# Altium schematic sheet [1] Supply.SchDoc
size A4
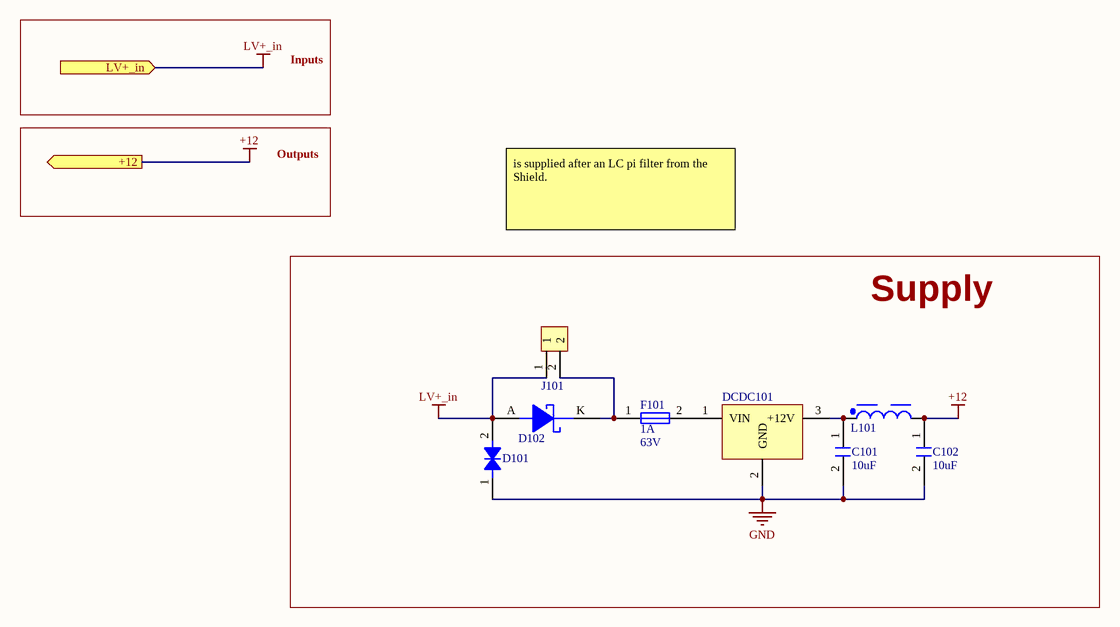
[diagram p0: [1] Supply.SchDoc]

## Parts
C101  Capacitance: 10uF  [C10u-50V-1210FNPMLCC-X7R]  (hidden comment: GRJ32ER71H106KE11L)
C102  Capacitance: 10uF  [C10u-50V-1210FNPMLCC-X7R]  (hidden comment: GRJ32ER71H106KE11L)
D101  824551301  [DTVS-DO-214AB]  (value not drawn)
D102  MBR0530  [DSC-SOD123]  (value not drawn)
DCDC101  173951236  [DCDC_Magi3c]  (value not drawn)
F101  Current Rating: 1A  Voltage Rating (DC): 63V  [Fuse_1206]  (hidden comment: 0437001.WRA)
J101  61300211121  [J_Pinheader_1x2]  (value not drawn)
L101  744042470  [L_Power_ 47uH]  (value not drawn)

## Blocks framed on the sheet
Supply: C101 C102 D101 D102 DCDC101 F101 J101 L101

## Ports
+12 (out), LV+_in (in)

## Nets
+12: C102.1 L101.2 ; port +12
GND: C101.2 C102.2 D101.1 DCDC101.2(GND)
LV+_in: D101.2 D102.A J101.1 ; port LV+_in
NetC101_1: C101.1 DCDC101.3(+12V) L101.1
NetD102_K: D102.K F101.1 J101.2
NetDCDC101_1: DCDC101.1(VIN) F101.2

## Notes on the sheet
- Inputs
- Outputs
- is supplied after an LC pi filter from the Shield.

## Library data of the parts
C101 C102 = C10u-50V-1210FNPMLCC-X7R: Multilayer Ceramic Capacitors MLCC - SMD/SMT 1210 10uF 50volts X7R +/-10% Soft Term; Manufacturer: Murata; Voltage Rating: 50V; Tolerance: 10%; .Creator: DR; Supplier 1: Avnet; Manufacturer Part Number: GRJ32ER71H106KE11L; RoHS: Yes; Category: Ceramic Capacitors; Stock 1: 19000; Pricing 1: 1000=0,33327, 2000=0,32389, 4000=0,31450, 6000=0,30511, 8000=0,29572 (USD); Mount: Surface Mount; Case/Package: 1210; Case Code (Metric): 3225; Case Code (Imperial): 1210; Min Operating Temperature: -55°C; Max Operating Temperature: 125°C; Packaging: Tape and Reel; Features: Soft Termination; Length: 0.126inch; Width: 0.098inch; Thickness: 0.11inch; RoHS Compliant: Yes; ComponentLink1URL: https://eu.mouser.com/datasheet/2/281/GRJ32ER71H106KE11_01-1977929.pdf; ComponentLink1Description: Datasheet; Supplier Part Number 1: GRJ32ER71H106KE11L
D101 = DTVS-40V-DO-214AB: TVS diode [Würth Elektronik] 824551301 TVS diode; Manufacturer: Wurth Electronics; Number of Bidirectional Channels: 1; Reverse Standoff Voltage: 30V; Min Breakdown Voltage: 35.05V; Clamping Voltage: 48.4V; Peak Pulse Power: 3kW; Power Line Protection: No; Polarity: Bidirectional; Peak Pulse Current: 62A; .Creator: DO; ComponentLink2Description: Where buy it; ComponentLink2URL: https://www.we-online.com/catalog/en/WE-TVSP?sq=824551301#824551301; Supplier 1: RSComponents; Manufacturer Part Number: 824551301; RoHS: Yes; Category: TVS Diodes; Stock 1: 1; Pricing 1: 10=1,72500, 50=1,54700, 100=1,45300, 250=1,35100, 500=1,15000 (USD); Mount: Surface Mount; Number of Pins: 2; Min Operating Temperature: -65°C; Max Operating Temperature: 150°C; Packaging: Cut Tape; Max Breakdown Voltage: 35.05V; Resistor Type: Zener; REACH SVHC: Unknown; RoHS Compliant: Yes; ComponentLink1URL: http://www.farnell.com/datasheets/2036459.pdf?src-supplier=Element14; ComponentLink1Description: http://www.farnell.com/datasheets/2036459.pdf?src-supplier=Element14; Supplier Part Number 1: 9217092P
D102 = DSC-0.5/30-SOD123: VR=30V IF=500mA 30pF P=410mW; Element Configuration: Single; Forward Voltage: 430mV; Peak Non-Repetitive Surge Current: 5.5A; Average Rectified Current: 500mA; Max Reverse Leakage Current: 130uA; Max Reverse Voltage (DC): 30V; Polarity: Standard; .Creator: GP; Category: Diode; ComponentLink1Description: Datasheet; ComponentLink1URL: *; ComponentLink2Description: Where buy it; ComponentLink2URL: *; Supplier 1: Newark; Stock 1: 9; Pricing 1: 1=0,34400, 10=0,23900, 100=0,12200, 500=0,10000 (USD); Mount: Surface Mount; Contact Plating: Tin,Matte; Weight: 0.03g; Package Quantity: 1; Max Surge Current: 5.5A; Forward Current: 500mA; Max Reverse Current: 130uA; Max Repetitive Reverse Voltage (Vrrm): 30V; Max Forward Surge Current (Ifsm): 5.5A; Voltage Rating (DC): 30V; Current Rating: 500mA; Output Current: 500mA; Series: -; Length: 2.7mm; Width: 1.6mm; Height: 1.03mm; Radiation Hardening: No; RoHS Compliant: Yes; REACH SVHC: No SVHC; Lead Free: Lead Free; ComponentLink3URL: https://datasheet.ciiva.com/30479/0900766b810e2512-30479401.pdf?src-supplier=RSComponents; ComponentLink3Description: https://datasheet.ciiva.com/30479/0900766b810e2512-30479401.pdf?src-supplier=RSComponents; ComponentLink4URL: https://datasheet.ciiva.com/34301/974753-34301826.pdf?src-supplier=Jameco; ComponentLink4Description: https://datasheet.ciiva.com/34301/974753-34301826.pdf?src-supplier=Jameco; ComponentLink5URL: https://datasheet.ciiva.com/910/mbr0530-910516.pdf?src-supplier=Digi-Key; ComponentLink5Description: https://datasheet.ciiva.com/910/mbr0530-910516.pdf?src-supplier=Digi-Key; ComponentLink6URL: https://datasheet.ciiva.com/25931/mbr0530-25931989.pdf?src-supplier=Avnet+Europe; ComponentLink6Description: https://datasheet.ciiva.com/25931/mbr0530-25931989.pdf?src-supplier=Avnet+Europe; ComponentLink7URL: https://datasheet.ciiva.com/8300/mbr0530-8300905.pdf?src-supplier=Avnet; ComponentLink7Description: https://datasheet.ciiva.com/8300/mbr0530-8300905.pdf?src-supplier=Avnet; ComponentLink8URL: https://datasheet.ciiva.com/17318/mbr0530-17318568.pdf?src-supplier=Future+Electronics; ComponentLink8Description: https://datasheet.ciiva.com/17318/mbr0530-17318568.pdf?src-supplier=Future+Electronics; ComponentLink9URL: https://datasheet.ciiva.com/15144/getdatasheetpartid-86760-15144598.pdf?src-supplier=Verical; ComponentLink9Description: https://datasheet.ciiva.com/15144/getdatasheetpartid-86760-15144598.pdf?src-supplier=Verical; ComponentLink10URL: https://datasheet.ciiva.com/910/mbr0530-910518.pdf?src-supplier=Digi-Key; ComponentLink10Description: https://datasheet.ciiva.com/910/mbr0530-910518.pdf?src-supplier=Digi-Key; Supplier Part Number 1: 15R3453
DCDC101 = DCDC-36V/12V-0.5A: Fdsm Fixed Step Down Regulator M; Manufacturer 1: Wurth Electronics; Supplier 1: Digi-Key; Manufacturer Part Number 1: 173951236; RoHS: No; Category: Board Mount Modules; Stock 1: 32; Pricing 1: 1=3,29000, 10=2,99100, 20=2,81300, 30=2,63600, 43=2,39907 (USD); Supplier Part Number 1: 732-173951236-ND; ComponentLink1Description: Datasheet; ComponentLink1URL: https://www.we-online.com/catalog/datasheet/173951236.pdf
F101 = Fuse_1A_63V_1206: Fuse Chip Fast Acting 1A 63V SMD Solder Pad 1206 Ceramic T/R Automotive; Manufacturer: Littelfuse; Fuse Type: Board Mount (Cartridge Style Excluded); Approvals: CSA,cURus; .Creator: DO; Supplier 1: Digi-Key; Manufacturer Part Number: 0437001.WRA; RoHS: Yes; Category: Fuses; Stock 1: 5820; Pricing 1: 1=1,52000, 5=1,47000, 10=1,37600, 50=1,13860, 100=0,94880, 250=0,92508, 500=0,78276, 1000=0,68788 (USD); Mount: Surface Mount; Case/Package: 1206; Case Code (Imperial): 1206; Case Code (Metric): 3216; Min Operating Temperature: -55°C; Max Operating Temperature: 150°C; Packaging: Tape and Reel; Voltage Rating (AC): 63V; ComponentLink1URL: https://www.littelfuse.com/~/media/electronics/datasheets/fuses/littelfuse_fuse_437a_datasheet.pdf.pdf?src-supplier=Digi-Key; ComponentLink1Description: https://www.littelfuse.com/~/media/electronics/datasheets/fuses/littelfuse_fuse_437a_datasheet.pdf.pdf?src-supplier=Digi-Key; Supplier Part Number 1: F10001CT-ND; ComponentLink2Description: Where buy it; ComponentLink2URL: https://www.mouser.es/ProductDetail/Littelfuse/0437001WRA?qs=DXv0QSHKF4z9CJhPXjxR%252BA%3D%3D
J101 = J_Jumper: CONN HEADER 2 POS 2.54; Manufacturer: Molex; Temperature rating: -40° to +105°C; Category type: PCB-PCB; Product name: Pin Header; Maximum current: 3 A; Maximum voltage: 250 V AC; Connections: 1x2; Current Rating: 3A; Voltage Rating: 250V; Number of Positions: 2; Gender: Male; Connector Type: Male Pin; Pitch: 0.1inch; .Creator: GP; Category: Connector; ComponentLink1Description: Datasheet; ComponentLink1URL: https://www.we-online.com/catalog/datasheet/61300211121.pdf; ComponentLink2Description: Where buy it; ComponentLink2URL: https://www.we-online.com/catalog/en/PHD_2_54_THT_PIN_HEADER_6130XX11121?sq=61300211121&sp=https%3A%2F%2Fwww.we-online.com%2Fweb%2Fen%2Fwuerth_elektronik%2Fsearchpage.php%3Fsearch%3D61300211121#61300211121; Manufacturer part number: 61300211121; Supplier: Würth Elektronik; RoHS: *; Application: Shortcircuit; Flammability: 94V-0; Orientation: Vertical; Mount: Through hole; Supplier 1: RSComponents; Stock 1: 1855; Pricing 1: 5=0,14100, 50=0,09700, 100=0,07800, 200=0,07300, 500=0,06800 (USD); Contact Plating: Gold; Housing Material: PBT; Contact Material: Copper Alloy,Copper; Color: Black; Min Operating Temperature: -40°C; Max Operating Temperature: 125°C; Number of Rows: 1; Contact Gender: Male; Packaging: Bulk; Termination: Through Hole; Number of Contacts: 2; Contact Mating Length: 0.236inch; REACH SVHC: Unknown; Lead Free: Lead Free; ComponentLink3URL: https://datasheet.ciiva.com/13619/6130xx11121-48870-13619345.pdf?src-supplier=Mouser; ComponentLink3Description: https://datasheet.ciiva.com/13619/6130xx11121-48870-13619345.pdf?src-supplier=Mouser; Supplier Part Number 1: 8281581
L101 = L_47uH_0.6A: WE-TPC SMT Tiny Power Inductor, size 4818, 47uH, 0.62A, 540mOhm; Manufacturer: Wurth Elektronik; Case/Size Code: 4818; Saturation Current: 0.45A; Self Resonant Frequency: 15MHz; Manufacturer Part Number: 744042470; Category: Power Inductors; Match Code: WE-TPC; ComponentLink1Description: Website Link; ComponentLink1URL: https://www.we-online.com/redexpert/article/744042470?ad; ComponentLink2Description: Datasheet Link; ComponentLink2URL: https://www.we-online.com/redexpert/spec/744042470?ad; Mount: Surface Mount; Operating Temperature Max: 125°C; Operating Temperature Min: -40°C; Packaging: Tape and Reel; Length: 4.8mm; Width: 4.8mm; Height: 1.8mm; DC Resistance: 540mOhm; Inductance: 47uH; Rated Current: 0.62A